# Altium schematic sheet Digital_Attenuator_Amp.SchDoc: Pounder
size 420 x 297 mm; Author: G.Kasprowicz; CompanyName: WUT ISE; DrawnBy: G.Kasprowicz; Organization: WUT ISE; Address1: PW ISE; Address2: Nowowiejska 15/19 00-665 Warsaw; Address3: gkasprow@gmail.com; DocumentNumber: 3; Revision: 2; SheetNumber: 3; SheetTotal: 7; ModifiedBy: -; CheckedDate: -; Title2: Attenuator & Power amplifier; DivGrp: WUT ISE; Designer: G.Kasprowicz; ModifiedDate: -; ProjectName: Sensor Box
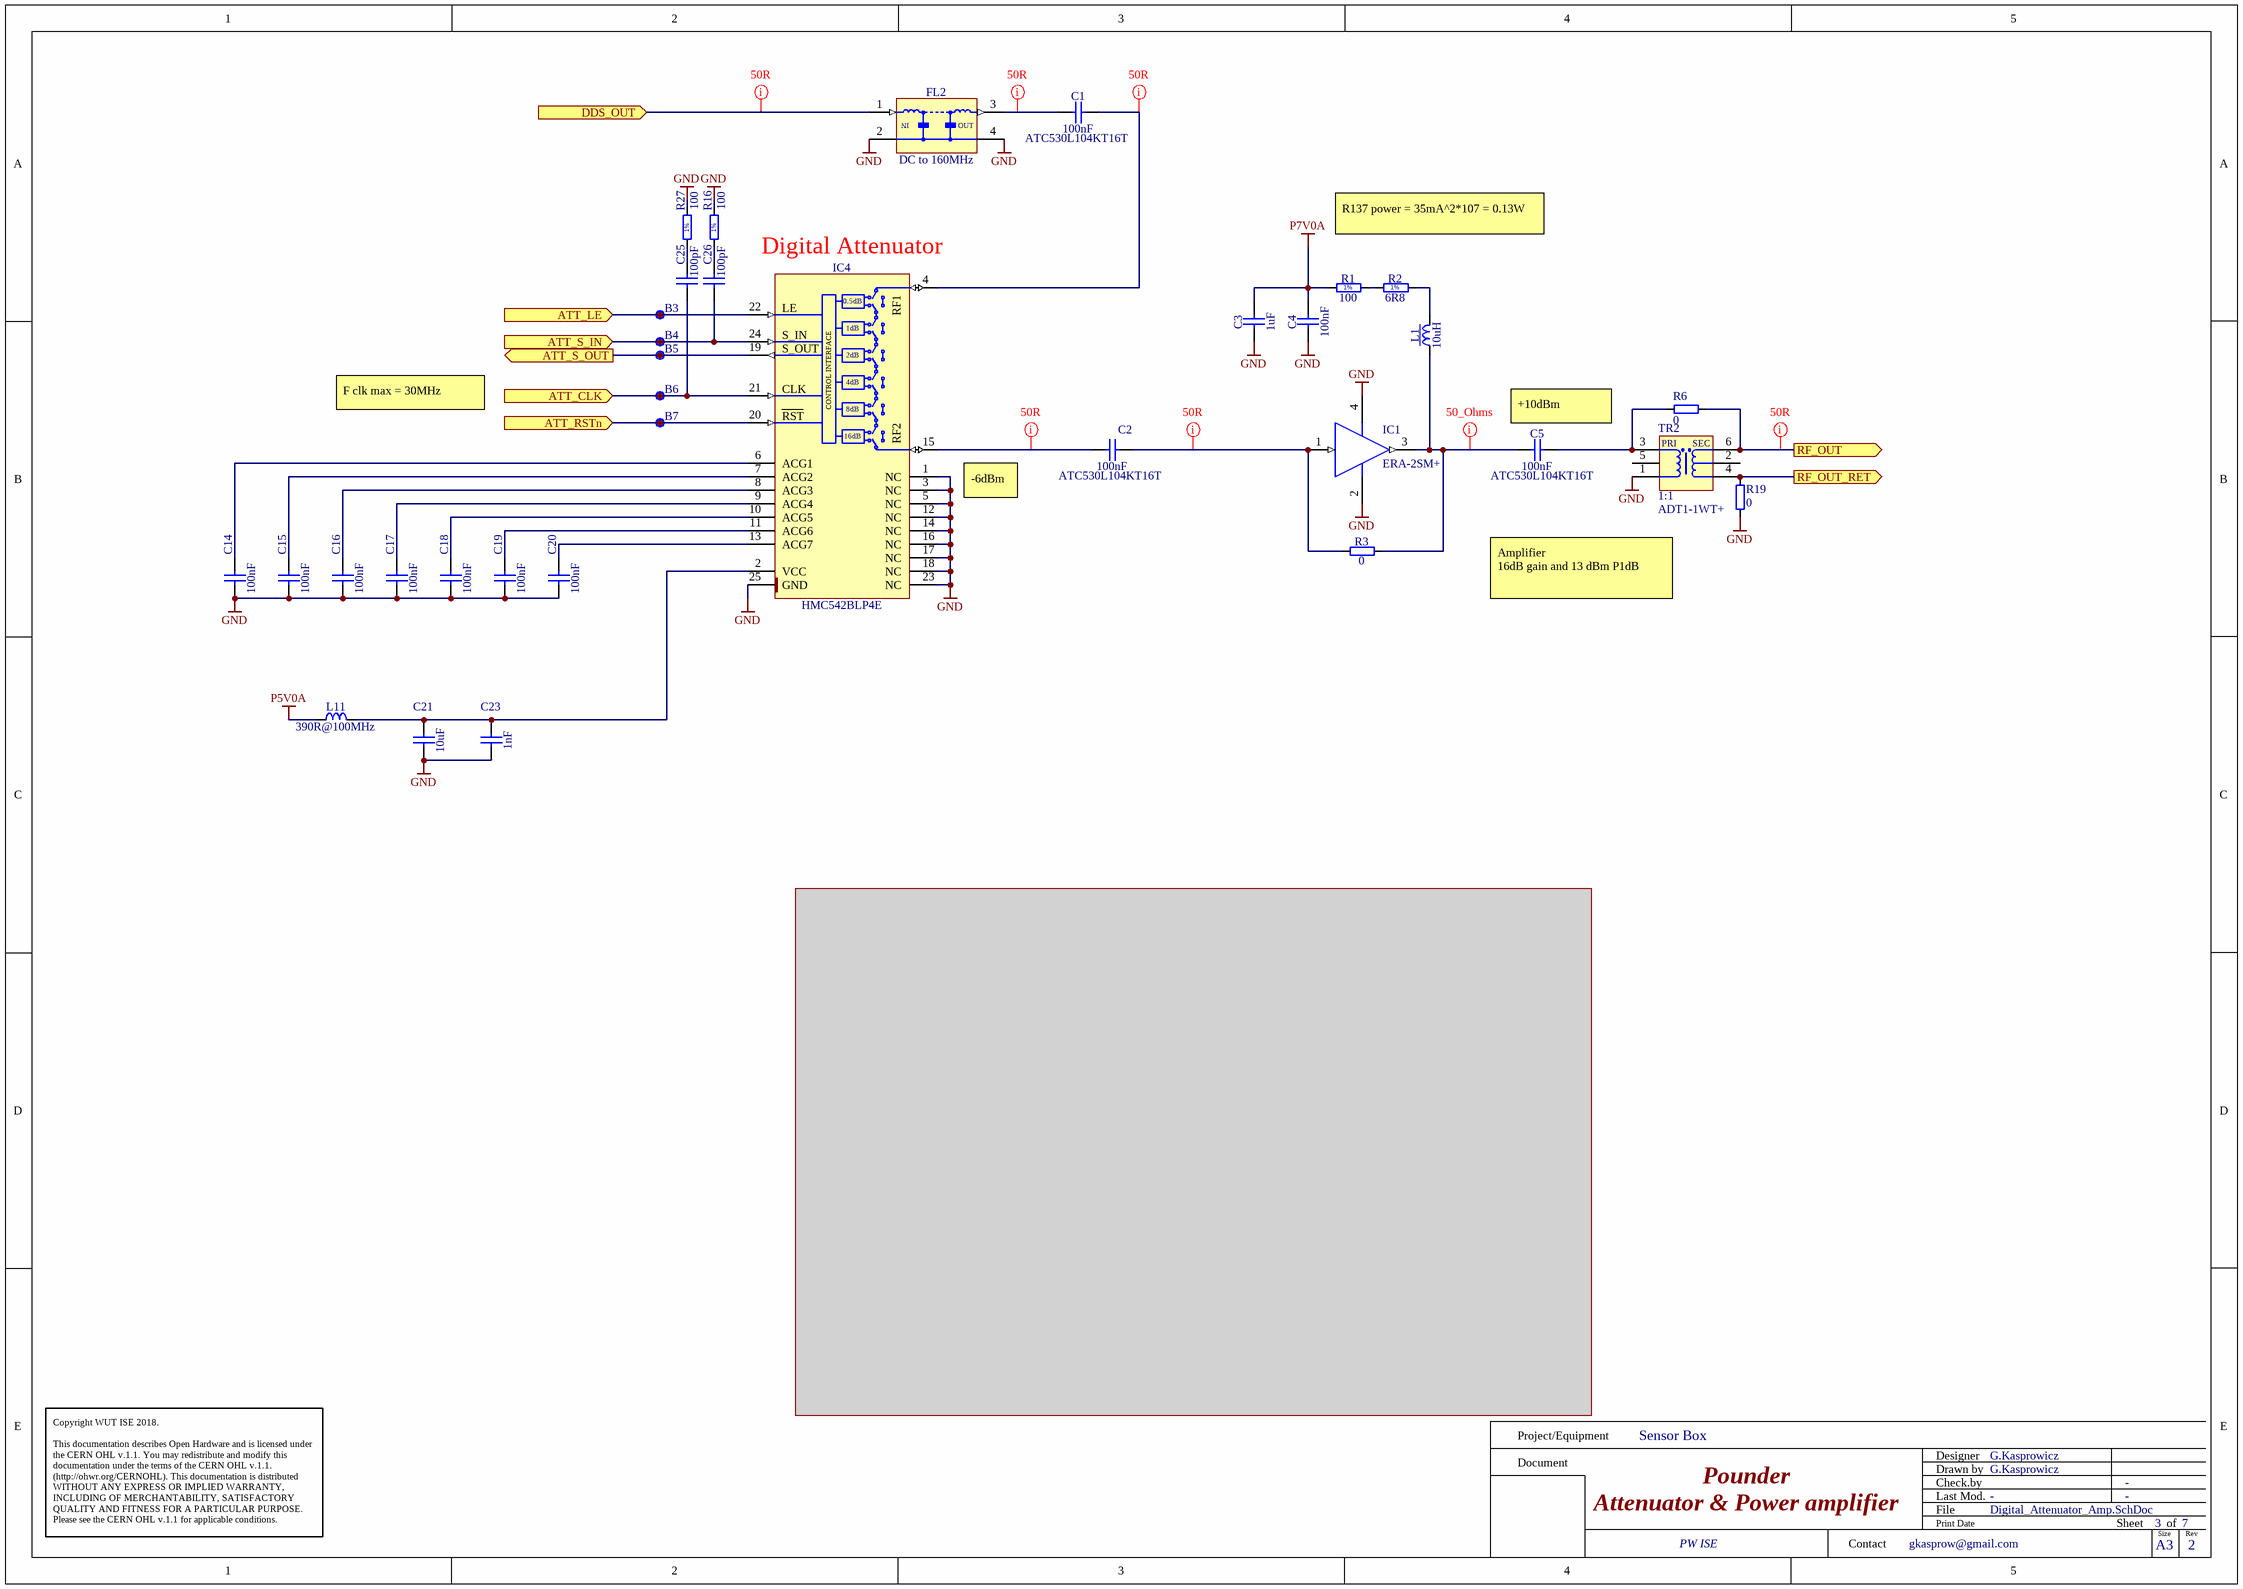
[diagram p0: Digital_Attenuator_Amp.SchDoc]

## Parts
B3  SMD Pad  [C100]  (value not drawn)
B4  SMD Pad  [C100]  (value not drawn)
B5  SMD Pad  [C100]  (value not drawn)
B6  SMD Pad  [C100]  (value not drawn)
B7  SMD Pad  [C100]  (value not drawn)
C1  100nF  Manufacturer Part Number: ATC530L104KT16T  [CAPC1005X70N]
C2  100nF  Manufacturer Part Number: ATC530L104KT16T  [CAPC1005X70N]
C3  1uF  [CAPC2012X140N]
C4  100nF  [CAPC1005X55N]
C5  100nF  Manufacturer Part Number: ATC530L104KT16T  [CAPC1005X70N]
C14  100nF  [CAPC1005X55N]
C15  100nF  [CAPC1005X55N]
C16  100nF  [CAPC1005X55N]
C17  100nF  [CAPC1005X55N]
C18  100nF  [CAPC1005X55N]
C19  100nF  [CAPC1005X55N]
C20  100nF  [CAPC1005X55N]
C21  10uF  [CAPC1608X80N]
C23  1nF  [CAPC1005X55N]
C25  100pF  [CAPC1005X55N]
C26  100pF  [CAPC1005X55N]
FL2  DC to 160MHz  [FIL_MINI-CIRCUITS_FV1206]
IC1  ERA-2SM+  [MINI-CIRCUITS_WW107]
IC4  HMC542BLP4E  [QFN50P400X400X100-25N-S295]
L1  10uH  [IND_MURATA_LQH32C]
L11  390R@100MHz  [INDC1608X95N]
R1  100  [RESC3216X65N]
R2  6R8  [RESC1608X55N]
R3  0  [RESC1608X55N]
R6  0  [RESC1005X40N]
R16  100  [RESC1005X40N]
R19  0  [RESC1005X40N]
R27  100  [RESC1005X40N]
TR2  1:1  Manufacturer Part Number: ADT1-1WT+  [XFMR_MINI-CIRCUITS_CD542]

## Ports
ATT_CLK (in), ATT_LE (in), ATT_RSTn (in), ATT_S_IN (in), ATT_S_OUT (out), DDS_OUT (in), RF_OUT (out), RF_OUT_RET (out)

## Nets
GND: C3.1 C4.1 C14.1 C15.1 C16.1 C17.1 C18.1 C19.1 C20.1 C21.1 C23.1 FL2.2(GND) FL2.4(GND) IC1.2(GND) IC1.4(GND) IC4.1(NC) IC4.3(NC) IC4.5(NC) IC4.12(NC) IC4.14(NC) IC4.16(NC) IC4.17(NC) IC4.18(NC) IC4.23(NC) IC4.25(GND) R16.2 R19.1 R27.2 TR2.1(P)
P5V0A: L11.1
P7V0A: C3.2 C4.2 R1.1
ATT_CLK: B6.1 C25.2 IC4.21(SHIFT_CLOCK) ; port ATT_CLK
ATT_LE: B3.1 IC4.22(LATCH_ENABLE) ; port ATT_LE
ATT_RSTn: B7.1 IC4.20(~{RESET}) ; port ATT_RSTn
ATT_S_IN: B4.1 C26.2 IC4.24(SERIAL_INPUT) ; port ATT_S_IN
ATT_S_OUT: B5.1 IC4.19(SERIAL_OUTPUT) ; port ATT_S_OUT
DDS_OUT: FL2.1(RFIN) ; port DDS_OUT
RF_OUT: R6.1 TR2.6(SDOT) ; port RF_OUT
RF_OUT_RET: R19.2 TR2.4(S) ; port RF_OUT_RET
NetC1_1: C1.1 FL2.3(RFOUT)
NetC1_2: C1.2 IC4.4(RF1)
NetC2_1: C2.1 IC4.15(RF2)
NetC2_2: C2.2 IC1.1(RF_IN) R3.1
NetC5_1: C5.1 IC1.3(RF_OUT) L1.1 R3.2
NetC5_2: C5.2 R6.2 TR2.3(PDOT)
NetC14_2: C14.2 IC4.6(ACG1)
NetC15_2: C15.2 IC4.7(ACG2)
NetC16_2: C16.2 IC4.8(ACG3)
NetC17_2: C17.2 IC4.9(ACG4)
NetC18_2: C18.2 IC4.10(ACG5)
NetC19_2: C19.2 IC4.11(ACG6)
NetC20_2: C20.2 IC4.13(ACG7)
NetC21_2: C21.2 C23.2 IC4.2(VCC) L11.2
NetC25_1: C25.1 R27.1
NetC26_1: C26.1 R16.1
NetL1_2: L1.2 R2.2
NetR1_2: R1.2 R2.1

Not connected (* = marked no-connect by the designer): TR2 2(SCT) 5(NC)

## Layout directives
net class 50_Ohms: NetC5_1
net class Z50R: DDS_OUT, NetC1_1, NetC1_2, NetC2_1, NetC2_2, RF_OUT

## Notes on the sheet
- (near IC4) Digital Attenuator
- R137 power = 35mA^2*107 = 0.13W
- F clk max = 30MHz
- (near C5) +10dBm
- -6dBm
- Amplifier
  16dB gain and 13 dBm P1dB
- Project/Equipment
- Document
- Designer
- Drawn by
- Check.by
- Copyright WUT ISE 2018.
  This documentation describes Open Hardware and is licensed under the CERN OHL v.1.1. You may redistribute and modify this documentation under the terms of the CERN OHL v.1.1. (http://ohwr.org/CERNOHL). This documentation is distributed WITHOUT ANY EXPRESS OR IMPLIED WARRANTY, INCLUDING OF MERCHANTABILITY, SATISFACTORY QUALITY AND FITNESS FOR A PARTICULAR PURPOSE. Please see the CERN OHL v.1.1 for applicable conditions.
- Contact
- File
- Last Mod.
- Print Date
- Sheet
- Size
- A3
- of
- Rev
- (in symbol FIL_MINI-CIRCUITS_LFCN-160+) IN; OUT
- (in symbol HMC542BLP4E) 0.5dB; LE; 1dB; S_IN; S_OUT; 2dB; CONTROL INTERFACE; 4dB; CLK; 8dB; RST; 16dB
- (in symbol R0402_100R_1%_0.0625W_100PPM) 1%
- (in symbol R0603_6R8_1%_0.1W_200PPM) 1%
- (in symbol R1206_100R_1%_0.5W_100PPM_VISHAY_CRCW-HP e3) 1%
- (in symbol XFMR_MINI-CIRCUITS_ADT1-1WT+) PRI; SEC

## Library data of the parts
B3-B7 = SMD_PAD_D1MM: Through Hole Pad; Part Description: 1mm Diameter SMD Pad; Mounted: No; Part Number: SMD_PAD_D1MM; Component Kind: Standard (No BOM); Component Type: Standard (No BOM); Pin Count: 1; Family: SMD Pad; Socket: No; SMD: No; Sense: No; Status: None; ComponentHeight: 0mm; HelpURL: Undefined; Author: CERN DEM JLC; CreateDate: 10.10.2017; LatestRevisionDate: 10.10.2017; PackageDescription: 1mm Diameter SMD Pad
C1 C2 C5 = CC0402_100NF_16V_10%_X7R_ATC_ATC530L: Non-polarised capacitor; Part Description: Broadband SMD Multilayer Chip Ceramic Capacitor; Manufacturer: ATC; Voltage: 16V; TC: X7R; Tolerance: ±10%; Part Number: CC0402_100NF_16V_10%_X7R_ATC_ATC530L; Component Kind: Standard; Component Type: Standard; Pin Count: 2; Value: 100nF; Status: Not Recommended; Case: 0402; Mounted: Yes; Socket: No; SMD: Yes; Sense: No; ComponentHeight: 0.61mm; HelpURL: \\cern.ch\dfs\Applications\Altium\Datasheets\CC0402_X7R_ATC_ATC530L104KT16.pdf; Author: CERN DEM BC; CreateDate: 17.11.2017; LatestRevisionDate: 21.11.2017
C3 = CC0805_1UF_35V_20%_X7R: Non-polarised capacitor; Part Description: SMD Multilayer Chip Ceramic Capacitor; Manufacturer: GENERIC; Manufacturer1 Part Number: GMK212B7105MG-T; Voltage: 35V; TC: X7R; Tolerance: ±20%; Part Number: CC0805_1UF_35V_20%_X7R; Component Kind: Standard; Component Type: Standard; Pin Count: 2; Value: 1uF; Status: Not Recommended; Manufacturer Part Number: CC0805_1UF_35V_20%_X7R; Case: 0805; Mounted: Yes; Socket: No; SMD: Yes; Sense: No; Manufacturer1 Example: TAIYO YUDEN; Manufacturer1 ComponentHeight: 1.35mm; HelpURL: \\cern.ch\dfs\Applications\Altium\Datasheets\CC0805_X7R_TAIYO-YUDEN_HIGH-VALUE.pdf; Author: CERN DEM JLC; CreateDate: 2011-06-22; LatestRevisionDate: 2011-06-22
C4 C14-C20 = CC0402_100NF_16V_10%_X5R: Non-polarised capacitor; Part Description: SMD Multilayer Chip Ceramic Capacitor; Manufacturer: GENERIC; Manufacturer1 Part Number: GRM155R61C104KA88D; Voltage: 16V; TC: X5R; Tolerance: ±10%; Part Number: CC0402_100NF_16V_10%_X5R; Component Kind: Standard; Component Type: Standard; Pin Count: 2; Value: 100nF; Status: None; Manufacturer Part Number: CC0402_100NF_16V_10%_X5R; Case: 0402; Mounted: Yes; Socket: No; SMD: Yes; Sense: No; Manufacturer1 Example: MURATA; Manufacturer1 ComponentHeight: 0.55mm; HelpURL: \\cern.ch\dfs\Applications\Altium\Datasheets\CC0402_X5R_MURATA_GRM.pdf; Author: CERN DEM JLC; CreateDate: 10.12.2013; LatestRevisionDate: 10.12.2013
C21 = CC0603_10UF_16V_20%_X5R: Non-polarised capacitor; Part Description: SMD Multilayer Chip Ceramic Capacitor; Manufacturer: GENERIC; Manufacturer1 Part Number: GRM188R61C106MA73D; Voltage: 16V; TC: X5R; Tolerance: ±20%; Part Number: CC0603_10UF_16V_20%_X5R; Component Kind: Standard; Component Type: Standard; Pin Count: 2; Value: 10uF; Status: None; Manufacturer Part Number: CC0603_10UF_16V_20%_X5R; Case: 0603; Mounted: Yes; Socket: No; SMD: Yes; Sense: No; Manufacturer1 Example: MURATA; Manufacturer1 ComponentHeight: 0.8mm; HelpURL: \\cern.ch\dfs\Applications\Altium\Datasheets\CC0603_X5R_MURATA_GRM.pdf; Author: CERN DEM MR; CreateDate: 2016-03-02; LatestRevisionDate: 2016-03-02
C23 = CC0402_1NF_50V_10%_X7R: Non-polarised capacitor; Part Description: SMD Multilayer Chip Ceramic Capacitor; Manufacturer: GENERIC; Manufacturer1 Part Number: 223858715623; Voltage: 50V; TC: X7R; Tolerance: ±10%; Part Number: CC0402_1NF_50V_10%_X7R; Component Kind: Standard; Component Type: Standard; Pin Count: 2; Value: 1nF; Status: Not Recommended; Manufacturer Part Number: CC0402_1NF_50V_10%_X7R; Case: 0402; Mounted: Yes; Socket: No; SMD: Yes; Sense: No; Manufacturer1 Example: PHYCOMP; Manufacturer1 ComponentHeight: 0.55mm; HelpURL: \\cern.ch\dfs\Applications\Altium\Datasheets\CC0402_X7R_PHYCOMP.pdf; Author: CERN DEM JLC; CreateDate: 2007-12-03; LatestRevisionDate: 2007-12-03
C25 C26 = CC0402_100PF_50V_5%_C0G: Non-polarised capacitor; Part Description: SMD Multilayer Chip Ceramic Capacitor; Manufacturer: GENERIC; Manufacturer1 Part Number: C0402C101J5GACTU; Voltage: 50V; TC: C0G/NP0; Tolerance: ±5%; Part Number: CC0402_100PF_50V_5%_C0G; Component Kind: Standard; Component Type: Standard; Pin Count: 2; Value: 100pF; Status: Preferred; Manufacturer Part Number: CC0402_100PF_50V_5%_C0G; Case: 0402; Mounted: Yes; Socket: No; SMD: Yes; Sense: No; Manufacturer1 Example: KEMET; Manufacturer1 ComponentHeight: 0.55mm; HelpURL: \\cern.ch\dfs\Applications\Altium\Datasheets\CC0805_C0G_KEMET_(Commercial Grade).pdf; Author: CERN DEM JLC; CreateDate: 03.12.2007; LatestRevisionDate: 22.04.2015
FL2 = FIL_MINI-CIRCUITS_LFCN-160+: 50 Ohms DC to 160MHz Low Pass Filter; Part Description: 50 Ohm Low Pass Filter; Part Number: FIL_MINI-CIRCUITS_LFCN-160+; Component Kind: Standard; Component Type: Standard; Pin Count: 2; Value: DC to 160MHz; Status: None; Manufacturer: MINI-CIRCUITS; Manufacturer Part Number: LFCN-160+; Mounted: Yes; Socket: No; SMD: Yes; Sense: No; ComponentHeight: 0.94mm; HelpURL: \\cern.ch\dfs\Applications\Altium\Datasheets\FIL_MINI-CIRCUITS_LFCN-160+.pdf; Author: CERN DEM MR; CreateDate: 18.10.2019; LatestRevisionDate: 18.10.2019
IC1 = ERA-2SM+: Monolithic Amplifier; Part Description: DC-6GHz Monolithic Amplifier; Manufacturer: MINI-CIRCUITS; PressFit: No; Bonding: No; Part Number: ERA-2SM+; Component Kind: Standard; Component Type: Standard; Device: ERA-2SM+; PackageDescription: MINI-CIRCUITS WW107 Case, Body 2.16mm Diameter X 1.52mm H; Manufacturer Part Number: ERA-2SM+; Pin Count: 4; Mounted: Yes; Socket: No; SMD: Yes; Sense: No; ComponentHeight: 1.52mm; Author: CERN DEM JLC; HelpURL: \\cern.ch\dfs\Applications\Altium\Datasheets\ERA-2SM+.pdf; ComponentLink1URL: \\cern.ch\dfs\Applications\Altium\Datasheets\ERA-2SM+_Package-Drawing.pdf; ComponentLink1Description: Package Drawing; CreateDate: 09.12.2013; LatestRevisionDate: 09.12.2013
IC4 = HMC542BLP4E: 0.5dB LSB GaAs MMIC 6-bit Digital Serial Control Attenuator, DC - 4GHz; Part Description: 0.5dB LSB GaAs MMIC 6-bit Digital Serial Control Attenuator, DC to 4GHz; Manufacturer: HITTITE MICROWAVE CORP; PressFit: No; Bonding: No; Part Number: HMC542BLP4E; Component Kind: Standard; Component Type: Standard; Device: HMC542BLP4E; PackageDescription: QFN, 0.50mm Pitch, Square; 24 Pin, 4.00mm L X 4.00mm W X 1.00mm H Body (w/thermal Tab 2.95 X 2.95mm), IPC Medium Density; Manufacturer Part Number: HMC542BLP4E; Pin Count: 25; Case: QFN24; Mounted: Yes; Socket: No; SMD: Yes; Sense: No; ComponentHeight: 1mm; Author: CERN DEM JMW; HelpURL: \\cern.ch\dfs\Applications\Altium\Datasheets\HMC542BLP4E.pdf; CreateDate: 2016-08-17; LatestRevisionDate: 2016-08-17
L1 = IND_10UH_10%_MURATA_LQH32CN100K33L: Inductor With Core; Part Description: Chip Inductor (Chip Coil) for Choke Wire Wound Type; Manufacturer: MURATA; Power: 450mA; Resistance: 0.3R; Tolerance: ±10%; Part Number: IND_10UH_10%_MURATA_LQH32CN100K33L; Component Kind: Standard; Component Type: Standard; Pin Count: 2; Value: 10uH; Status: None; Manufacturer Part Number: LQH32CN100K33L; Mounted: Yes; Socket: No; SMD: Yes; Sense: No; ComponentHeight: 2.2mm; HelpURL: \\cern.ch\dfs\Applications\Altium\Datasheets\IND_MURATA_LQH32CN_33.pdf; Author: CERN DEM JLC; CreateDate: 06.04.2009; LatestRevisionDate: 04.07.2018
L11 = IND0603_TDK_MPZ1608R391A: Inductor; Part Description: SMT Chip Bead for Power Line; Manufacturer: TDK; Power: 1.2A; Resistance: 0.12R; Tolerance: ±25%; Part Number: IND0603_TDK_MPZ1608R391A; Component Kind: Standard; Component Type: Standard; Pin Count: 2; Value: 390R@100MHz; Status: None; Manufacturer Part Number: MPZ1608R391A; Case: 0603; Mounted: Yes; Socket: No; SMD: Yes; Sense: No; ComponentHeight: 0.95mm; HelpURL: \\cern.ch\dfs\Applications\Altium\Datasheets\IND0603_TDK_MPZ1608.pdf; Author: CERN DEM JLC; CreateDate: 2009-12-02; LatestRevisionDate: 2009-12-02
R1 = R1206_100R_1%_0.5W_100PPM_VISHAY_CRCW-HP e3: Resistor - 1%; Part Description: Pulse Proof, High Power Thick Film Chip Resistor; Manufacturer: VISHAY DRALORIC; Manufacturer Part Number: CRCW1206100RFKEAHP; Power: 0.5W; TC: ±100ppm/°C; Voltage: 200V; PressFit: No; Part Number: R1206_100R_1%_0.5W_100PPM_VISHAY_CRCW-HP e3; Component Kind: Standard; Component Type: Standard; Pin Count: 2; Value: 100; Status: None; Tolerance: ±1%; Case: 1206; Mounted: Yes; Sense: No; Socket: No; SMD: Yes; HelpURL: \\cern.ch\dfs\Applications\Altium\Datasheets\R1206_VISHAY_CRCW-HP e3.pdf; Author: CERN DEM JLC; CreateDate: 19.11.2013; LatestRevisionDate: 19.11.2013; ComponentHeight: 0.65mm
R2 = R0603_6R8_1%_0.1W_200PPM: Resistor - 1%; Part Description: General Purpose Thick Film Chip Resistor; Manufacturer: GENERIC; Manufacturer1 Part Number: 232270466808L or RC0603FR-076R8L; Power: 0.1W; TC: ±200ppm/°C; PressFit: No; Part Number: R0603_6R8_1%_0.1W_200PPM; Component Kind: Standard; Component Type: Standard; Pin Count: 2; Value: 6R8; Status: Preferred; Tolerance: ±1%; Manufacturer Part Number: R0603_6R8_1%_0.1W_200PPM; Case: 0603; Mounted: Yes; Sense: No; Socket: No; SMD: Yes; Manufacturer1 Example: YAGEO PHYCOMP; Manufacturer1 ComponentHeight: 0.65mm; HelpURL: \\cern.ch\dfs\Applications\Altium\Datasheets\R0603_Phycomp_RC0603.pdf; Author: CERN DEM JLC; CreateDate: 03.12.2007; LatestRevisionDate: 17.10.2012
R3 = R0603_0R_JUMPER: Resistor; Part Description: 1A (0.05R Max DC Resistance) Zero Ohm Jumper; Manufacturer: GENERIC; Manufacturer1 Part Number: NRC06Z0; PressFit: No; Part Number: R0603_0R_JUMPER; Component Kind: Standard; Component Type: Standard; Pin Count: 2; Value: 0; Status: Preferred; Manufacturer Part Number: R0603_0R_JUMPER; Case: 0603; Mounted: Yes; Sense: No; Socket: No; SMD: Yes; Manufacturer1 Example: NIC COMPONENT; Manufacturer1 ComponentHeight: 0.55mm; HelpURL: \\cern.ch\dfs\Applications\Altium\Datasheets\R0603_NIC_NRC.pdf; Author: CERN DEM JLC; CreateDate: 03/12/2007; LatestRevisionDate: 13/03/2008
R6 R19 = R0402_0R_JUMPER: Resistor; Part Description: 1A (0.05R Max DC Resistance) Zero Ohm Jumper; Manufacturer: GENERIC; Manufacturer1 Part Number: 232270591001L; Part Number: R0402_0R_JUMPER; Component Kind: Standard; Component Type: Standard; Pin Count: 2; Value: 0; Status: Not recommended; Manufacturer Part Number: R0402_0R_JUMPER; Case: 0402; Mounted: Yes; Sense: No; Socket: No; SMD: Yes; Manufacturer1 Example: YAGEO PHYCOMP; Manufacturer1 ComponentHeight: 0.4mm; HelpURL: \\cern.ch\dfs\Applications\Altium\Datasheets\R0402_Phycomp_RC0402.pdf; Author: CERN DEM JLC; CreateDate: 03.12.2007; LatestRevisionDate: 17.10.2012
R16 R27 = R0402_100R_1%_0.0625W_100PPM: Resistor - 1%; Part Description: General Purpose Thick Film Chip Resistor; Manufacturer: GENERIC; Manufacturer1 Part Number: 232270671001L; TC: ±100ppm/°C; PressFit: No; Part Number: R0402_100R_1%_0.0625W_100PPM; Component Kind: Standard; Component Type: Standard; Pin Count: 2; Value: 100; Status: Not Recommended; Power: 0.0625W; Tolerance: ±1%; Manufacturer Part Number: R0402_100R_1%_0.0625W_100PPM; Case: 0402; Mounted: Yes; Sense: No; Socket: No; SMD: Yes; Manufacturer1 Example: YAGEO PHYCOMP; Manufacturer1 ComponentHeight: 0.4mm; HelpURL: \\cern.ch\dfs\Applications\Altium\Datasheets\R0402_Phycomp_RC0402.pdf; Author: CERN DEM JLC; CreateDate: 03.12.2007; LatestRevisionDate: 17.10.2012
TR2 = XFMR_MINI-CIRCUITS_ADT1-1WT+: 75 Ohm 0.4 To 800MHz RF Transformers; Part Description: 75 Ohms 0.4 to 800 MHz RF Transformer; Part Number: XFMR_MINI-CIRCUITS_ADT1-1WT+; Component Kind: Standard; Component Type: Standard; Pin Count: 6; Value: 1:1; Status: None; Manufacturer: MINI-CIRCUITS; Mounted: Yes; Socket: No; Sense: No; SMD: Yes; ComponentHeight: 2.84mm; HelpURL: \\cern.ch\dfs\Applications\Altium\Datasheets\XFMR_MINI-CIRCUITS_ADT1-1WT+.pdf; Author: CERN DEM JLC; CreateDate: 21.09.2011; LatestRevisionDate: 21.09.2011